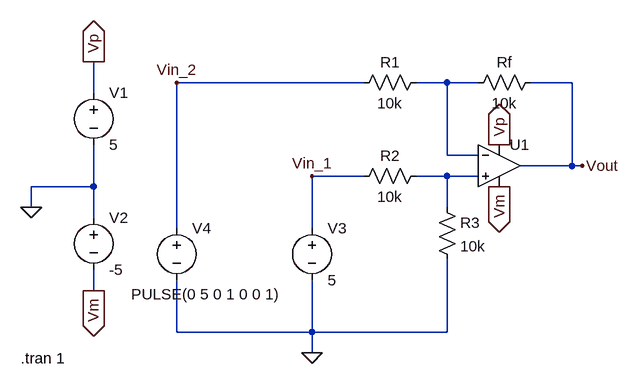
[diagram p0: schematic Differential-Amplifier.asc]
Differential-Amplifier.asc, the LTspice schematic file:
Version 4
SHEET 1 948 680
WIRE 528 0 240 0
WIRE 656 0 608 0
WIRE 704 0 656 0
WIRE 848 0 784 0
WIRE 112 16 112 -32
WIRE 656 112 656 0
WIRE 704 112 656 112
WIRE 848 128 848 0
WIRE 848 128 768 128
WIRE 864 128 848 128
WIRE 528 144 448 144
WIRE 656 144 608 144
WIRE 704 144 656 144
WIRE 112 160 112 96
WIRE 112 160 16 160
WIRE 16 192 16 160
WIRE 656 192 656 144
WIRE 112 208 112 160
WIRE 240 224 240 0
WIRE 448 224 448 144
WIRE 112 320 112 288
WIRE 240 384 240 304
WIRE 448 384 448 304
WIRE 448 384 240 384
WIRE 656 384 656 272
WIRE 656 384 448 384
WIRE 448 416 448 384
FLAG 16 192 0
FLAG 736 96 Vp
IOPIN 736 96 Out
FLAG 736 160 Vm
IOPIN 736 160 Out
FLAG 112 -32 Vp
IOPIN 112 -32 Out
FLAG 112 320 Vm
IOPIN 112 320 Out
FLAG 448 144 Vin_1
FLAG 240 0 Vin_2
FLAG 864 128 Vout
FLAG 448 416 0
SYMBOL voltage 112 0 R0
WINDOW 123 0 0 Left 0
WINDOW 39 0 0 Left 0
SYMATTR InstName V1
SYMATTR Value 5
SYMBOL voltage 112 192 R0
WINDOW 123 0 0 Left 0
WINDOW 39 0 0 Left 0
SYMATTR InstName V2
SYMATTR Value -5
SYMBOL OpAmps\\UniversalOpAmp 736 128 R0
SYMATTR InstName U1
SYMBOL res 800 -16 R90
WINDOW 0 0 56 VBottom 2
WINDOW 3 32 56 VTop 2
SYMATTR InstName Rf
SYMATTR Value 10k
SYMBOL res 624 -16 R90
WINDOW 0 0 56 VBottom 2
WINDOW 3 32 56 VTop 2
SYMATTR InstName R1
SYMATTR Value 10k
SYMBOL res 624 128 R90
WINDOW 0 0 56 VBottom 2
WINDOW 3 32 56 VTop 2
SYMATTR InstName R2
SYMATTR Value 10k
SYMBOL res 640 176 R0
SYMATTR InstName R3
SYMATTR Value 10k
SYMBOL voltage 448 208 R0
WINDOW 123 0 0 Left 0
WINDOW 39 0 0 Left 0
SYMATTR InstName V3
SYMATTR Value 5
SYMBOL voltage 240 208 R0
WINDOW 3 -70 118 Left 2
WINDOW 123 0 0 Left 0
WINDOW 39 0 0 Left 0
SYMATTR Value PULSE(0 5 0 1 0 0 1)
SYMATTR InstName V4
TEXT 0 424 Left 2 !.tran 1

The netlist it stands for:
* Differential-Amplifier.asc
V1 Vp 0 5
V2 0 Vm -5
XU1 N002 N001 Vp Vm Vout level1 Avol=1Meg GBW=10Meg Vos=0 En=0 Enk=0 In=0 Ink=0 Rin=500Meg  ; pins In+ In- V+ V- OUT
Rf Vout N001 10k
R1 N001 Vin_2 10k
R2 N002 Vin_1 10k
R3 N002 0 10k
V3 Vin_1 0 5
V4 Vin_2 0 PULSE(0 5 0 1 0 0 1)
.tran 1
.lib UniversalOpAmp1.lib
.backanno
.end